# Altium schematic sheet 532_Encoder.SchDoc
size A4; SheetNumber: 15; SheetTotal: 19
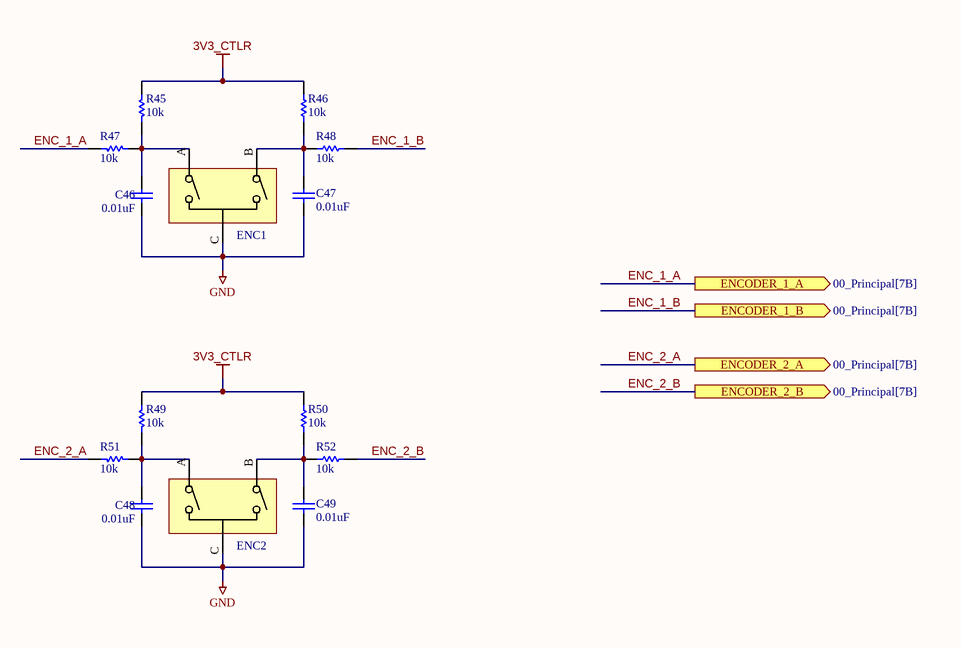
[diagram p0: 532_Encoder.SchDoc]

## Parts
C46  0.01uF  [CAPC1005X55X25LL05T10]
C47  0.01uF  [CAPC1005X55X25LL05T10]
C48  0.01uF  [CAPC1005X55X25LL05T10]
C49  0.01uF  [CAPC1005X55X25LL05T10]
ENC1  Encoder  [PEC09-2315F-N0015]  (value not drawn)
ENC2  Encoder  [PEC09-2315F-N0015]  (value not drawn)
R45  10k  [RESC1005X40X25ML05T05]
R46  10k  [RESC1005X40X25ML05T05]
R47  10k  [RESC1005X40X25ML05T05]
R48  10k  [RESC1005X40X25ML05T05]
R49  10k  [RESC1005X40X25ML05T05]
R50  10k  [RESC1005X40X25ML05T05]
R51  10k  [RESC1005X40X25ML05T05]
R52  10k  [RESC1005X40X25ML05T05]

## Ports
ENCODER_1_A (out, see 00_Principal[7B]), ENCODER_1_B (out, see 00_Principal[7B]), ENCODER_2_A (out, see 00_Principal[7B]), ENCODER_2_B (out, see 00_Principal[7B])

## Nets
3V3_CTLR: R45.1 R46.1 R49.1 R50.1
GND: C46.1 C47.1 C48.1 C49.1 ENC1.C(COM) ENC2.C(COM)
ENC_1_A: R47.1 ; port ENCODER_1_A
ENC_1_B: R48.1 ; port ENCODER_1_B
ENC_2_A: R51.1 ; port ENCODER_2_A
ENC_2_B: R52.1 ; port ENCODER_2_B
NetC46_2: C46.2 ENC1.A(COM) R45.2 R47.2
NetC47_2: C47.2 ENC1.B(COM) R46.2 R48.2
NetC48_2: C48.2 ENC2.A(COM) R49.2 R51.2
NetC49_2: C49.2 ENC2.B(COM) R50.2 R52.2

## Library data of the parts
C46-C49 = CMP-1034-01880-2: Manufacturer: Murata; Part Number: GRM155R71E103KA01D
ENC1 ENC2 = PEC09-2315F-N0015: PEC09 PC Pin Quadrature (Incremental) 12 Mechanical Encoder 11.4mm 70C; Manufacturer: Bourns; Built in Switch: No; Detent: Yes; Number of Circuits: 1; Output Type: Incremental, Quadrature; Pulses per Revolution: 12; Supplier: DigiKey; Supplier Part Number: 118-PEC09-2315F-N0015-ND; Manufacturer Part Number: PEC09-2315F-N0015; RoHS: Compliant; Category: Encoders; Stock: 1221; Pricing: 1=2.47, 10=2.078, 25=1.9392, 50=1.8398, 100=1.745, 300=1.60387, 500=1.54196, 1000=1.46156, 5000=1.29003 (USD); Country of Origin: Taiwan; Encoder Type: Mechanical; Introduction Date: 2010-10-15; Lifecycle Status: Production; Max Operating Temperature: 70°C; Min Operating Temperature: -10°C; Mounting Technology: PCB, Panel, Through Hole; Orientation: Right Angle; REACH SVHC: Yes; Schedule B: 8543709655; Termination: PC Pin; Width: 9.7mm; ComponentLink1URL: https://datasheet.octopart.com:443/PEC09-2315F-N0015-Bourns-datasheet-179971531.pdf?src-supplier=IHS; ComponentLink1Description: https://datasheet.octopart.com:443/PEC09-2315F-N0015-Bourns-datasheet-179971531.pdf?src-supplier=IHS; ComponentLink2URL: https://datasheet.octopart.com:443/PEC09-2315F-N0015-Bourns-datasheet-67810299.pdf?src-supplier=JRH+Electronics; ComponentLink2Description: https://datasheet.octopart.com:443/PEC09-2315F-N0015-Bourns-datasheet-67810299.pdf?src-supplier=JRH+Electronics; ComponentLink3URL: https://datasheet.octopart.com:443/PEC09-2315F-N0015-Bourns-datasheet-177040331.pdf?src-supplier=Burklin+Elektronik; ComponentLink3Description: https://datasheet.octopart.com:443/PEC09-2315F-N0015-Bourns-datasheet-177040331.pdf?src-supplier=Burklin+Elektronik; ComponentLink4URL: https://datasheet.octopart.com/PEC09-2315F-N0015-Bourns-datasheet-10938969.pdf; ComponentLink4Description: https://datasheet.octopart.com/PEC09-2315F-N0015-Bourns-datasheet-10938969.pdf; ComponentLink5URL: http://sigma.octopart.com:80/conflict_mineral_statement/Bourns-company-36.pdf?src-supplier=Compliance+Statements; ComponentLink5Description: http://sigma.octopart.com:80/conflict_mineral_statement/Bourns-company-36.pdf?src-supplier=Compliance+Statements
R45-R52 = CMP-2002-00601-1: Manufacturer: Panasonic; Part Number: ERJ-2RHD1002X